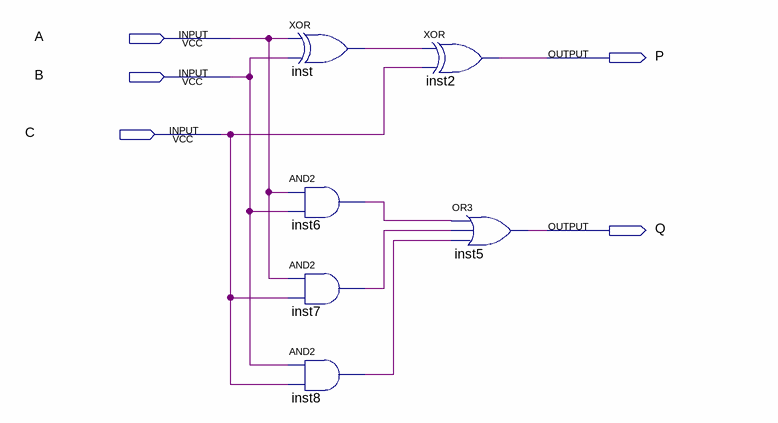
[diagram p0: schematic sheet]
// Quartus schematic FullAdder.bdf as structural Verilog: 6 symbols, 5 pins
module FullAdder (
  input  A,
  input  B,
  input  C,
  output P,
  output Q
);

  wire inst6_out, inst7_out, inst8_out, inst_out;

  xor inst (inst_out, A, B);
  and inst6 (inst6_out, A, B);
  and inst7 (inst7_out, A, C);
  and inst8 (inst8_out, B, C);
  xor inst2 (P, inst_out, C);
  or inst5 (Q, inst6_out, inst7_out, inst8_out);
endmodule
